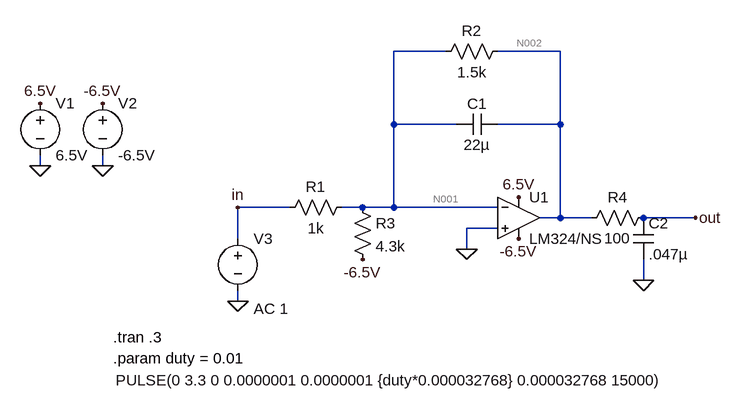
[diagram p0: schematic Mixer.asc]
Mixer.asc, the LTspice schematic file:
Version 4
SHEET 1 2296 768
WIRE 288 -32 208 -32
WIRE 464 -32 368 -32
WIRE 208 80 208 -32
WIRE 304 80 208 80
WIRE 464 80 464 -32
WIRE 464 80 368 80
WIRE -336 144 -336 128
WIRE -240 144 -240 128
WIRE 48 208 -32 208
WIRE 160 208 128 208
WIRE 208 208 208 80
WIRE 208 208 160 208
WIRE 368 208 208 208
WIRE 464 224 464 80
WIRE 464 224 432 224
WIRE 512 224 464 224
WIRE 672 224 592 224
WIRE 368 240 320 240
WIRE -32 256 -32 208
WIRE 320 272 320 240
WIRE 592 320 592 288
WIRE -32 352 -32 336
FLAG -240 144 0
FLAG -336 144 0
FLAG -240 48 -6.5V
FLAG 400 256 -6.5V
FLAG -32 352 0
FLAG -32 208 in
FLAG 672 224 out
FLAG -336 48 6.5V
FLAG 400 192 6.5V
FLAG 320 272 0
FLAG 160 288 -6.5V
FLAG 592 320 0
SYMBOL ZZZ\\OpAmp\\LM324 400 224 R0
SYMATTR InstName U1
SYMBOL voltage -336 32 R0
WINDOW 123 0 0 Left 0
WINDOW 39 0 0 Left 0
SYMATTR InstName V1
SYMATTR Value 6.5V
SYMBOL voltage -240 32 R0
WINDOW 123 0 0 Left 0
WINDOW 39 0 0 Left 0
SYMATTR InstName V2
SYMATTR Value -6.5V
SYMBOL cap 368 64 R90
WINDOW 0 0 32 VBottom 2
WINDOW 3 32 32 VTop 2
SYMATTR InstName C1
SYMATTR Value 22µ
SYMBOL res 384 -48 R90
WINDOW 0 0 56 VBottom 2
WINDOW 3 32 56 VTop 2
SYMATTR InstName R2
SYMATTR Value 1.5k
SYMBOL res 32 224 R270
WINDOW 0 32 56 VTop 2
WINDOW 3 0 56 VBottom 2
SYMATTR InstName R1
SYMATTR Value 1k
SYMBOL voltage -32 240 R0
WINDOW 3 -188 234 Left 2
WINDOW 123 24 124 Left 2
WINDOW 39 0 0 Left 0
SYMATTR Value PULSE(0 3.3 0 0.0000001 0.0000001 {duty*0.000032768} 0.000032768 15000)
SYMATTR Value2 AC 1
SYMATTR InstName V3
SYMBOL res 144 192 R0
SYMATTR InstName R3
SYMATTR Value 4.3k
SYMBOL res 608 208 R90
WINDOW 0 0 56 VBottom 2
WINDOW 3 32 56 VTop 2
SYMATTR InstName R4
SYMATTR Value 100
SYMBOL cap 576 224 R0
SYMATTR InstName C2
SYMATTR Value .047µ
TEXT -224 408 Left 2 !.tran .3
TEXT -224 440 Left 2 !.param duty = 0.01

The netlist it stands for:
* Mixer.asc
XU1 0 N001 6.5V -6.5V N002 LM324/NS  ; pins In+ In- V+ V- OUT
V1 6.5V 0 6.5V
V2 -6.5V 0 -6.5V
C1 N002 N001 22µ
R2 N002 N001 1.5k
R1 in N001 1k
V3 in 0 PULSE(0 3.3 0 0.0000001 0.0000001 {duty*0.000032768} 0.000032768 15000) AC 1
R3 N001 -6.5V 4.3k
R4 out N002 100
C2 out 0 .047µ
.tran .3
.param duty = 0.01
.backanno
.end

* Results of the author's LTspice run, read from the files saved beside the schematic
* Operating Point, zero values left out:
*   V(n001) = 1.976 mV
*   V(6.5v) = 6.5 V
*   V(-6.5v) = -6.5 V
*   V(n002) = 2.273 V
*   V(out) = 2.273 V
*   I(R3) = 1.512 mA
*   I(R1) = -1.976 µA
*   I(R2) = 1.514 mA
*   I(V3) = 1.976 µA
*   I(V2) = 1.496 mA
*   I(V1) = -1.498 mA
*   Ix(u1:1) = -51.91 nA
*   Ix(u1:2) = -38 nA
*   Ix(u1:99) = 1.498 mA
*   Ix(u1:50) = 16.42 µA
*   Ix(u1:28) = -1.514 mA